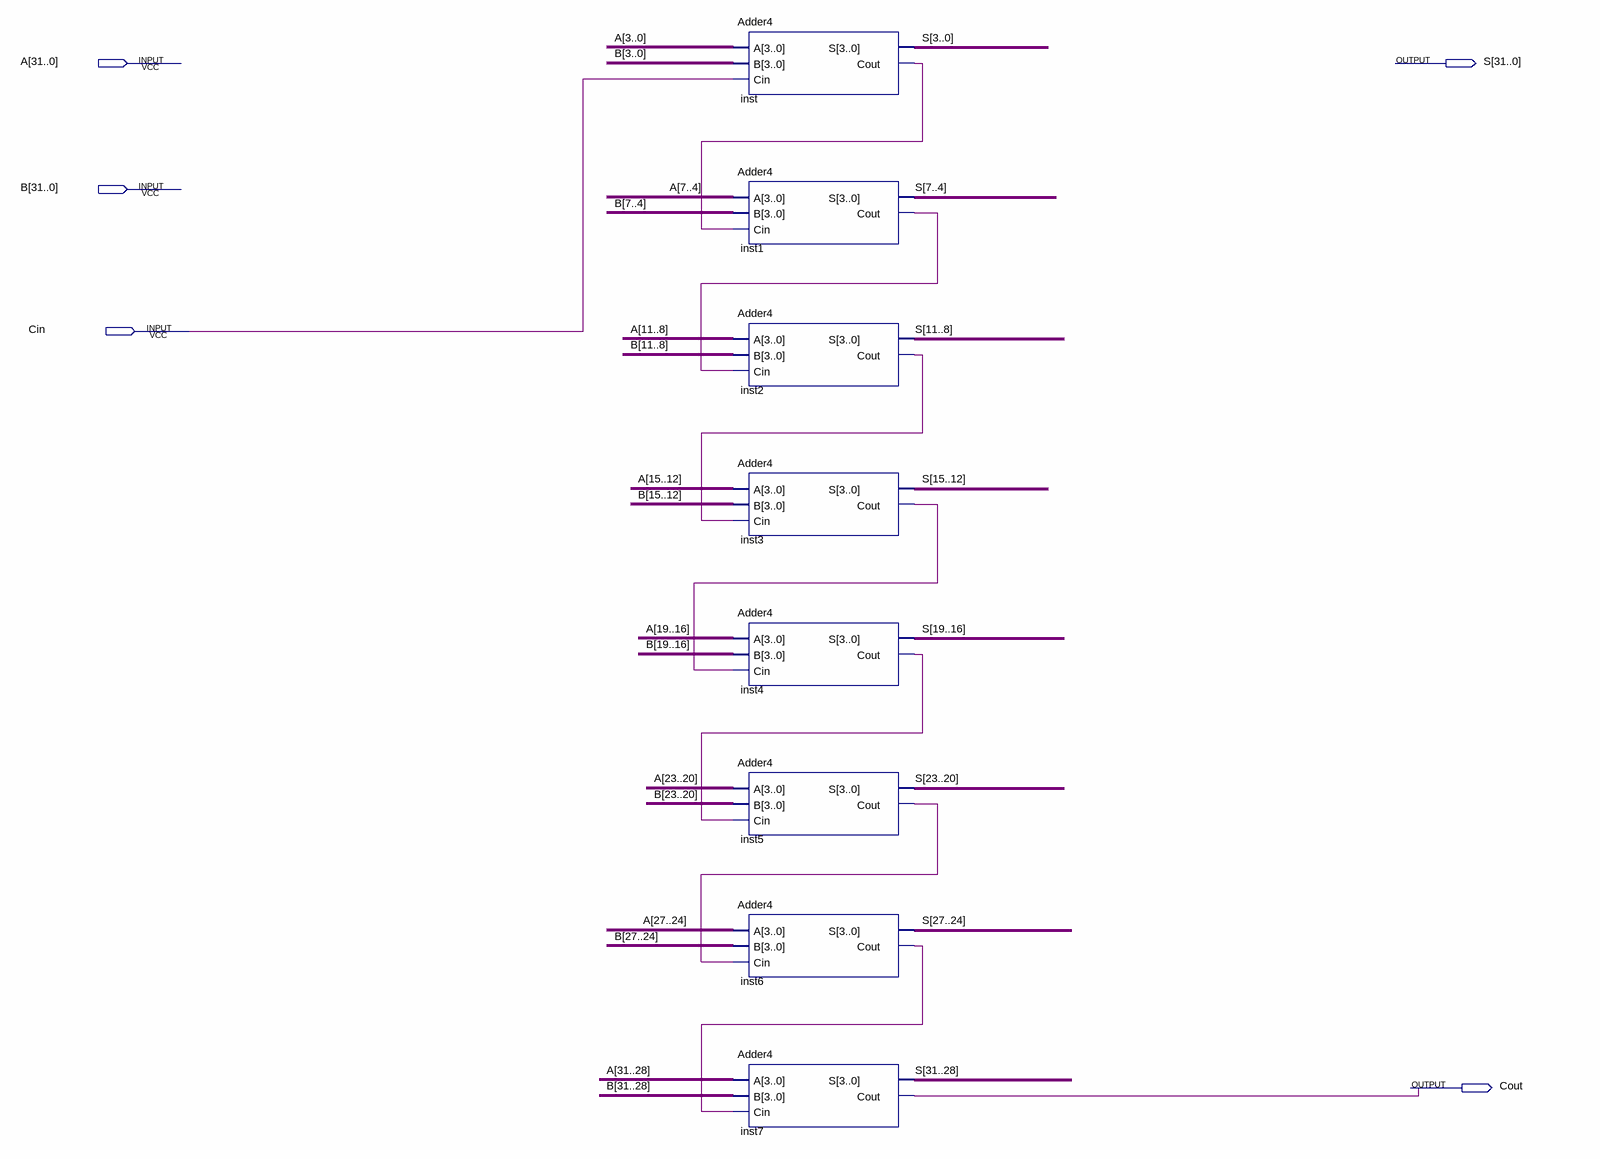
[diagram p0: schematic sheet]
// Quartus schematic Adder32.bdf as structural Verilog: 8 symbols, 5 pins
module Adder32 (
  input  [31:0] A,
  input  [31:0] B,
  input  Cin,
  output [31:0] S,
  output Cout
);

  wire inst1_cout, inst2_cout, inst3_cout, inst4_cout, inst5_cout, inst6_cout, inst7_cout, inst_cout;

  Adder4 inst (.A(A[3:0]), .B(B[3:0]), .Cin(Cin), .S(S[3:0]), .Cout(inst_cout));
  Adder4 inst1 (.A(A[7:4]), .B(B[7:4]), .Cin(inst_cout), .S(S[7:4]), .Cout(inst1_cout));
  Adder4 inst2 (.A(A[11:8]), .B(B[11:8]), .Cin(inst1_cout), .S(S[11:8]), .Cout(inst2_cout));
  Adder4 inst3 (.A(A[15:12]), .B(B[15:12]), .Cin(inst2_cout), .S(S[15:12]), .Cout(inst3_cout));
  Adder4 inst4 (.A(A[19:16]), .B(B[19:16]), .Cin(inst3_cout), .S(S[19:16]), .Cout(inst4_cout));
  Adder4 inst5 (.A(A[23:20]), .B(B[23:20]), .Cin(inst4_cout), .S(S[23:20]), .Cout(inst5_cout));
  Adder4 inst6 (.A(A[27:24]), .B(B[27:24]), .Cin(inst5_cout), .S(S[27:24]), .Cout(inst6_cout));
  Adder4 inst7 (.A(A[31:28]), .B(B[31:28]), .Cin(inst6_cout), .S(S[31:28]), .Cout(inst7_cout));
endmodule
